# Altium schematic sheet accessoryidk.SchDoc
size 297 x 209 mm
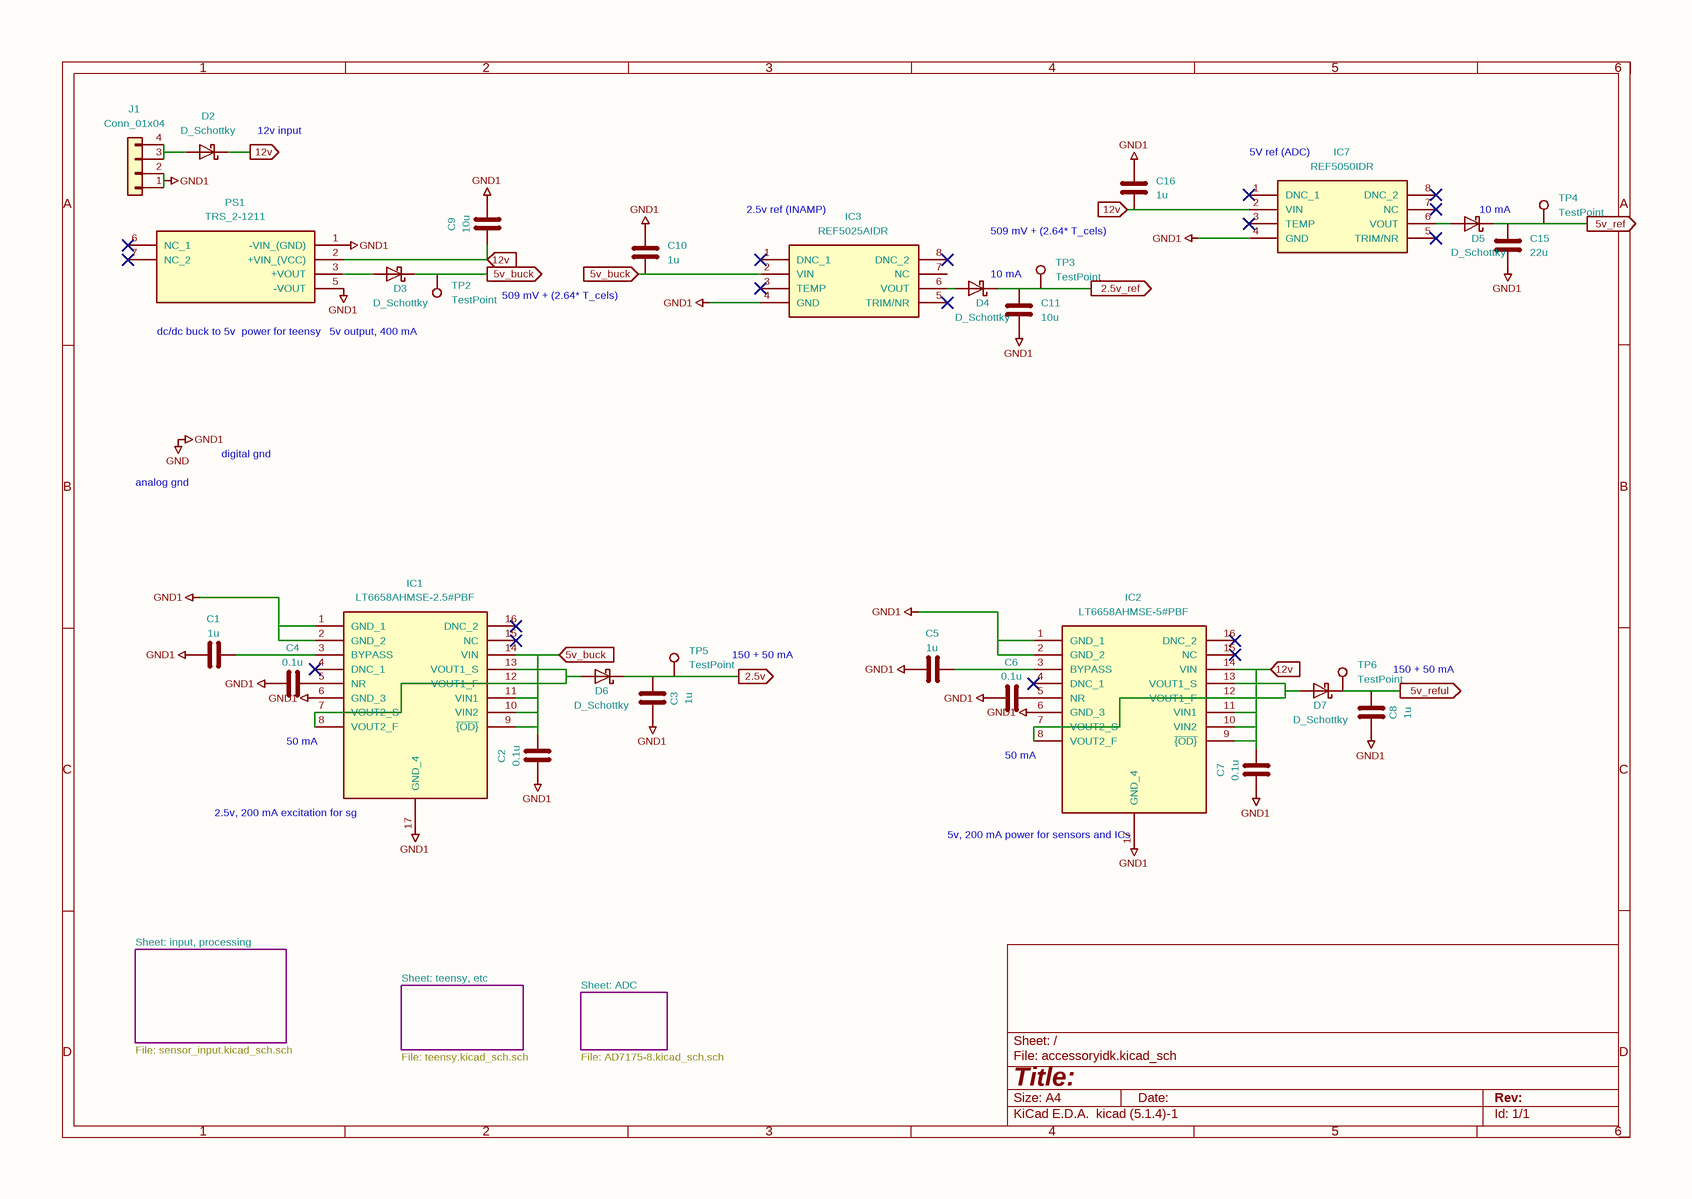
[diagram p0: accessoryidk.SchDoc]

## Parts
C1  1u  [C_0603_1608Metric]
C2  0.1u  [C_0603_1608Metric]
C3  1u  [C_0603_1608Metric]
C4  0.1u  [C_0603_1608Metric]
C5  1u  [C_0603_1608Metric]
C6  0.1u  [C_0603_1608Metric]
C7  0.1u  [C_0603_1608Metric]
C8  1u  [C_0603_1608Metric]
C9  10u  [C_1206_3216Metric]
C10  1u  [C_0603_1608Metric]
C11  10u  [C_0603_1608Metric]
C15  22u  [C_0603_1608Metric]
C16  1u  [C_0603_1608Metric]
D2  D_Schottky  [D_1206_3216Metric]
D3  D_Schottky  [D_0603_1608Metric]
D4  D_Schottky  [D_0603_1608Metric]
D5  D_Schottky  [D_0603_1608Metric]
D6  D_Schottky  [D_0603_1608Metric]
D7  D_Schottky  [D_0603_1608Metric]
IC1  LT6658AHMSE-2.5#PBF  [SOP50P490X110-17N]
IC2  LT6658AHMSE-5#PBF  [SOP50P490X110-17N]
IC3  REF5025AIDR  [SOIC127P599X175-8N]
IC7  REF5050IDR  [SOIC127P599X175-8N]
J1  Conn_01x04  [JST_EH_B4B-EH-A_1x04_P2.50mm_Vertical]
PS1  TRS_2-1211  [CONV_TRS_2-2419]
TP2  TestPoint  [TestPoint_Pad_2.0x2.0mm]
TP3  TestPoint  [TestPoint_Pad_2.0x2.0mm]
TP4  TestPoint  [TestPoint_Pad_2.0x2.0mm]
TP5  TestPoint  [TestPoint_Pad_2.0x2.0mm]
TP6  TestPoint  [TestPoint_Pad_2.0x2.0mm]

## Sub-sheets
ADC = AD7175-8.SchDoc: no entries
input, processing = sensor_input.SchDoc: no entries
teensy, etc = teensy.SchDoc: no entries

## Ports
2.5v (out), 2.5v_ref (out), 5v_buck (in), 5v_buck (out), 5v_ref (out), 5v_reful (out), 12v (in), 12v (out)

## Nets
GND: C1.1 C2.1 C3.1 C4.1 C5.1 C6.1 C7.1 C8.1 C9.2 C10.2 C11.2 C15.2 C16.2 IC1.1(GND_1) IC1.2(GND_2) IC1.6(GND_3) IC1.17(GND_4) IC2.1(GND_1) IC2.2(GND_2) IC2.6(GND_3) IC2.17(GND_4) IC3.4(GND) IC7.4(GND) J1.1(Pin_1) J1.2(Pin_2) PS1.1(-VIN_(GND)) PS1.5(-VOUT)  [also labelled GND1]
2.5v: C3.2 D6.1(K) TP5.1 ; port 2.5v
2.5v_ref: C11.1 D4.1(K) TP3.1 ; port 2.5v_ref
5v_buck: C2.2 C10.1 D3.1(K) IC1.9(~{{OD}}) IC1.10(VIN2) IC1.11(VIN1) IC1.14(VIN) IC3.2(VIN) TP2.1 ; port 5v_buck
5v_ref: C15.1 D5.1(K) TP4.1 ; port 5v_ref
5v_reful: C8.2 D7.1(K) TP6.1 ; port 5v_reful
12v: C7.2 C9.1 C16.1 D2.1(K) IC2.9(~{{OD}}) IC2.10(VIN2) IC2.11(VIN1) IC2.14(VIN) IC7.2(VIN) PS1.2(+VIN_(VCC)) ; port 12v
NetC1_2: C1.2 IC1.3(BYPASS)
NetC4_2: C4.2 IC1.5(NR)
NetC5_2: C5.2 IC2.3(BYPASS)
NetC6_2: C6.2 IC2.5(NR)
NetD2_2: D2.2(A) J1.3(Pin_3) J1.4(Pin_4)
NetD3_2: D3.2(A) PS1.3(+VOUT)
NetD4_2: D4.2(A) IC3.6(VOUT)
NetD5_2: D5.2(A) IC7.6(VOUT)
NetD6_2: D6.2(A) IC1.7(VOUT2_S) IC1.8(VOUT2_F) IC1.12(VOUT1_F) IC1.13(VOUT1_S)
NetD7_2: D7.2(A) IC2.7(VOUT2_S) IC2.8(VOUT2_F) IC2.12(VOUT1_F) IC2.13(VOUT1_S)

Not connected (* = marked no-connect by the designer): IC1 4(DNC_1)* 15(NC)* 16(DNC_2)*; IC2 4(DNC_1)* 15(NC)* 16(DNC_2)*; IC3 1(DNC_1)* 3(TEMP)* 5(TRIM/NR)* 7(NC) 8(DNC_2)*; IC7 1(DNC_1)* 3(TEMP)* 5(TRIM/NR)* 7(NC)* 8(DNC_2)*; PS1 6(NC_1)* 7(NC_2)*

## Notes on the sheet
- (near D2) 12v input
- (near IC3) 2.5v ref (INAMP)
- (near IC7) 5V ref (ADC)
- (near D5) 10 mA
- (near D4) 10 mA
- 509 mV + (2.64* T_cels)
- (near PS1) dc/dc buck to 5v
  power for teensy
- 5v output, 400 mA
- analog gnd
- digital gnd
- 150 + 50 mA
- (near IC1) 50 mA
- (near IC2) 50 mA
- (near IC1) 2.5v, 200 mA excitation for sg
- (near IC2) 5v, 200 mA power for sensors and ICs
- Sheet: input, processing
- Sheet: teensy, etc
- Sheet: ADC
- File: sensor_input.kicad_sch.sch
- File: teensy.kicad_sch.sch
- File: AD7175-8.kicad_sch.sch
- 1
- 2
- 3
- 4
- 5
- 6
- A
- B
- C
- D
- Title:
- File: accessoryidk.kicad_sch
- Sheet: /
- KiCad E.D.A.  kicad (5.1.4)-1
- Size: A4
- Date:
- Rev:
- Id: 1/1

## Library data of the parts
C1-C11 C15 C16 = C
  C1 C3 C5 C8 C10 C16: Value: 1u; Footprint: Capacitor_SMD:C_0603_1608Metric
  C2 C4 C6 C7: Value: 0.1u; Footprint: Capacitor_SMD:C_0603_1608Metric
  C9: Value: 10u; Footprint: Capacitor_SMD:C_1206_3216Metric
  C11: Value: 10u; Footprint: Capacitor_SMD:C_0603_1608Metric
  C15: Value: 22u; Footprint: Capacitor_SMD:C_0603_1608Metric
IC1 = LT6658AHMSE-2.5#PBF: Manufacturer_Name: Analog Devices; Height: 1.1; Mouser Part Number: 584-LT6658AHMSE5PBF; Mouser Price/Stock: https://www.mouser.co.uk/ProductDetail/Analog-Devices/LT6658AHMSE-5PBF?qs=W0yvOO0ixfFdSUQ4xUcBUw%3D%3D; Manufacturer_Part_Number: LT6658AHMSE-2.5#PBF; Value: LT6658AHMSE-2.5#PBF; Footprint: 21xt_footprints:SOP50P490X110-17N
IC2 = LT6658AHMSE-5#PBF: Manufacturer_Name: Analog Devices; Height: 1.1; Mouser Part Number: 584-LT6658AHMSE5PBF; Mouser Price/Stock: https://www.mouser.co.uk/ProductDetail/Analog-Devices/LT6658AHMSE-5PBF?qs=W0yvOO0ixfFdSUQ4xUcBUw%3D%3D; Manufacturer_Part_Number: LT6658AHMSE-5#PBF; Value: LT6658AHMSE-5#PBF; Footprint: 21xt_footprints:SOP50P490X110-17N
IC3 IC7 = REF5050IDR: Manufacturer_Name: Texas Instruments; Height: 1.75; Mouser Part Number: 595-REF5050IDR; Mouser Price/Stock: https://www.mouser.co.uk/ProductDetail/Texas-Instruments/REF5050IDR?qs=xL7PkI2RoJ6ioxG%2FxfIGUw%3D%3D; Manufacturer_Part_Number: REF5050IDR; Footprint: 21xt_footprints:SOIC127P599X175-8N
  IC3: Value: REF5025AIDR
  IC7: Value: REF5050IDR
PS1 = TRS_2-1211: Manufacturer_Name: Traco Power; Manufacturer_Part_Number: TRS 2-1211; Height: 8; Mouser Part Number: 495-TRS2-1211; Mouser Price/Stock: https://www.mouser.co.uk/ProductDetail/TRACO-Power/TRS-2-1211?qs=wUXugUrL1qziI%252BEzex2I6g%3D%3D; Value: TRS_2-1211; Footprint: 21xt_footprints:CONV_TRS_2-2419
D2-D7 = D_Schottky: Value: D_Schottky
  D2: Footprint: Diode_SMD:D_1206_3216Metric
  D3-D7: Footprint: Diode_SMD:D_0603_1608Metric
J1 = Conn_01x04: Value: Conn_01x04; Footprint: Connector_JST:JST_EH_B4B-EH-A_1x04_P2.50mm_Vertical
TP2-TP6 = TestPoint: Value: TestPoint; Footprint: TestPoint:TestPoint_Pad_2.0x2.0mm